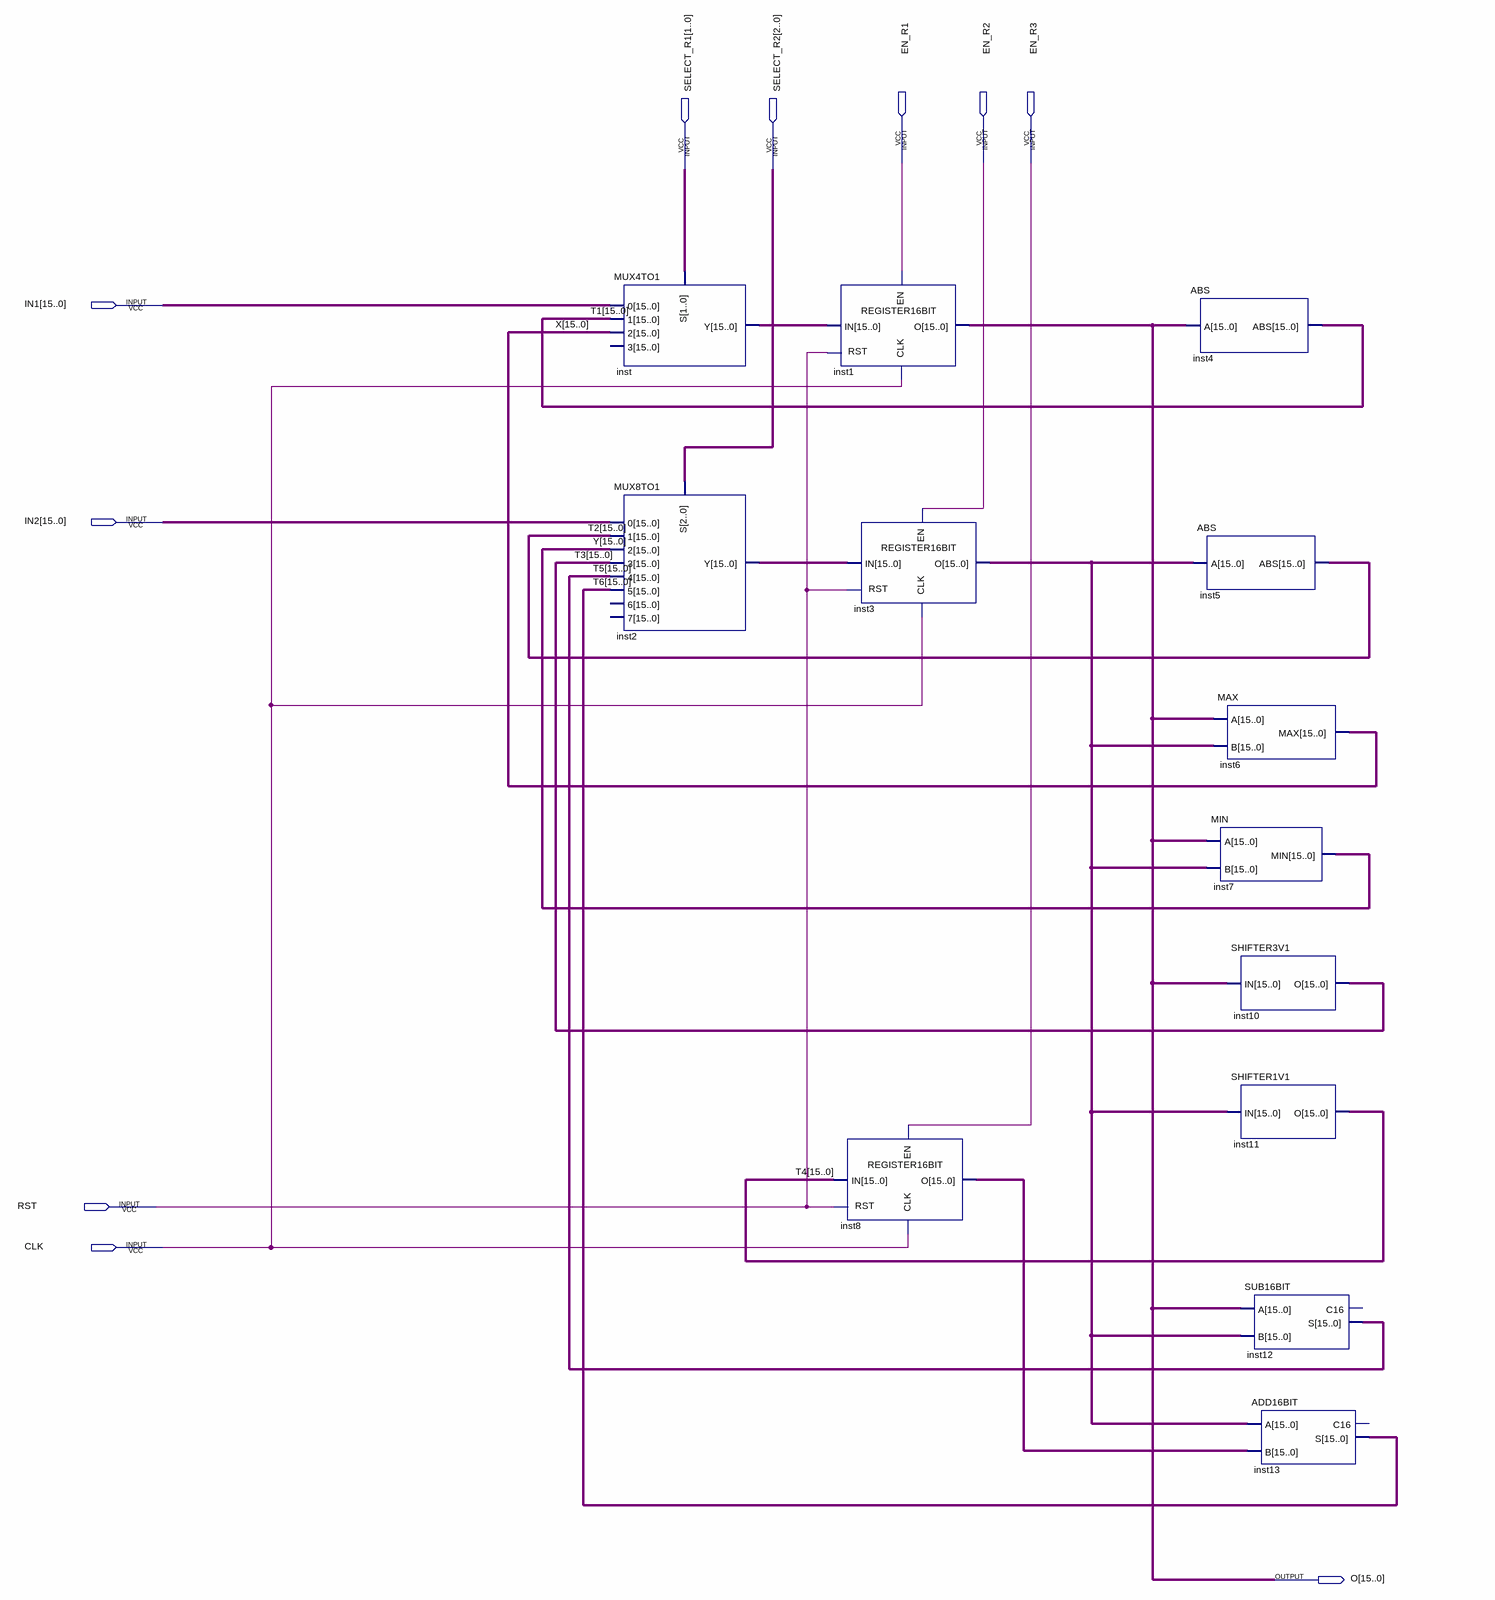
[diagram p0: schematic sheet]
// Quartus schematic DATAPATH_SHAREREGISTER.bdf as structural Verilog: 13 symbols, 10 pins
module DATAPATH_SHAREREGISTER (
  input  EN_R1,
  input  EN_R2,
  input  EN_R3,
  input  [1:0] SELECT_R1,
  input  [2:0] SELECT_R2,
  input  [15:0] IN1,
  input  [15:0] IN2,
  input  RST,
  input  CLK,
  output [15:0] O
);

  wire [15:0] inst2_y, inst3_o, inst8_o, inst_y, T1, T2, T3, T4, T5, T6, X, Y;

  MUX4TO1 inst (.\0 (IN1), .\1 (T1), .\2 (X), .S(SELECT_R1), .Y(inst_y));  // open: 3
  MUX8TO1 inst2 (.S(SELECT_R2), .\0 (IN2), .\1 (T2), .\2 (Y), .\3 (T3), .\4 (T5), .\5 (T6), .Y(inst2_y));  // open: 6, 7
  REGISTER16BIT inst1 (.IN(inst_y), .EN(EN_R1), .CLK(CLK), .RST(RST), .O(O));
  REGISTER16BIT inst3 (.IN(inst2_y), .EN(EN_R2), .CLK(CLK), .RST(RST), .O(inst3_o));
  REGISTER16BIT inst8 (.IN(T4), .EN(EN_R3), .CLK(CLK), .RST(RST), .O(inst8_o));
  ABS inst4 (.A(O), .ABS(T1));
  ABS inst5 (.A(inst3_o), .ABS(T2));
  MAX inst6 (.A(O), .B(inst3_o), .MAX(X));
  MIN inst7 (.A(O), .B(inst3_o), .MIN(Y));
  SHIFTER3V1 inst10 (.IN(O), .O(T3));
  SHIFTER1V1 inst11 (.IN(inst3_o), .O(T4));
  SUB16BIT inst12 (.A(O), .B(inst3_o), .S(T5));  // open: C16
  ADD16BIT inst13 (.A(inst3_o), .B(inst8_o), .S(T6));  // open: C16
endmodule
